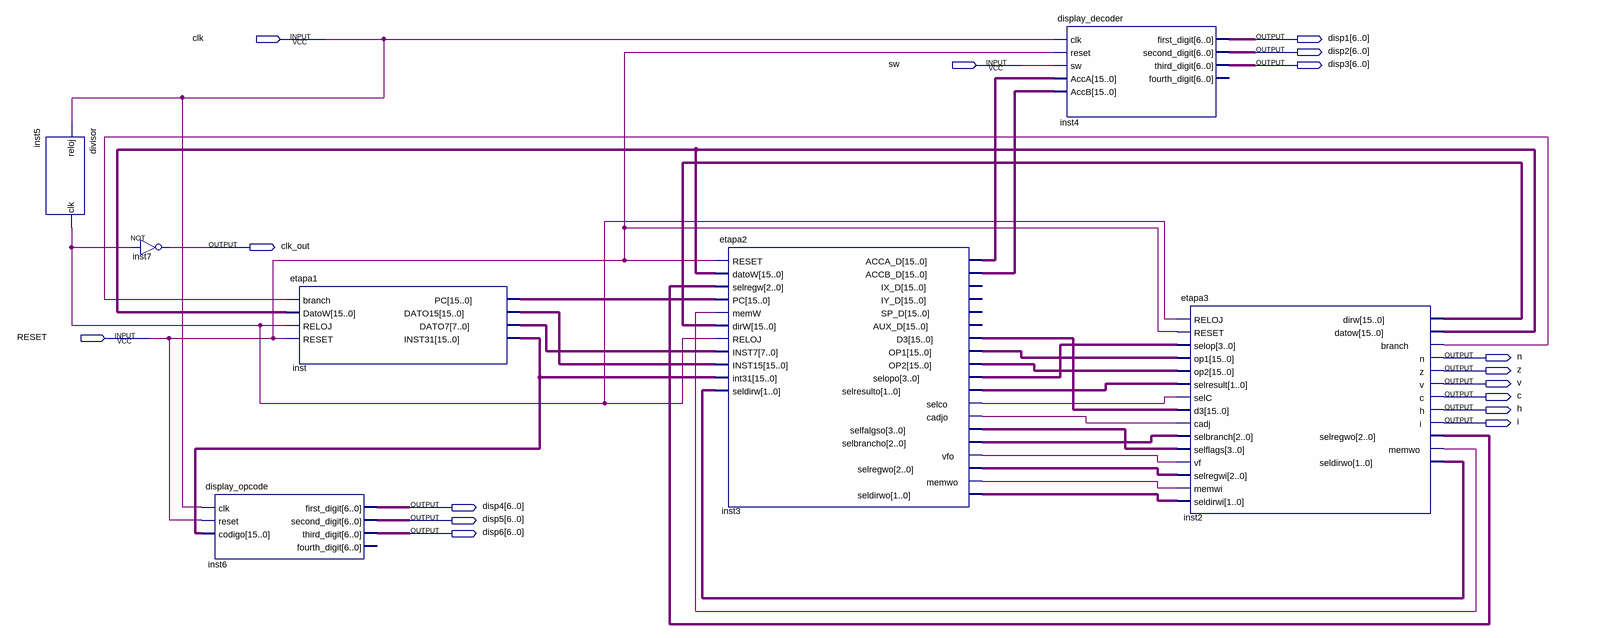
[diagram p0: schematic sheet]
// Quartus schematic pipeline.bdf as structural Verilog: 7 symbols, 16 pins
module pipeline (
  input  clk,
  input  sw,
  input  RESET,
  output [6:0] disp1,
  output [6:0] disp2,
  output [6:0] disp3,
  output clk_out,
  output n,
  output z,
  output v,
  output c,
  output h,
  output i,
  output [6:0] disp4,
  output [6:0] disp5,
  output [6:0] disp6
);

  wire inst2_branch, inst2_memwo, inst3_cadjo, inst3_memwo, inst3_selco, inst3_vfo, inst5_clk;
  wire [1:0] inst2_seldirwo, inst3_seldirwo, inst3_selresulto;
  wire [2:0] inst2_selregwo, inst3_selbrancho, inst3_selregwo;
  wire [3:0] inst3_selfalgso, inst3_selopo;
  wire [7:0] inst_dato7;
  wire [15:0] inst2_datow, inst2_dirw, inst3_acca_d, inst3_accb_d, inst3_d3, inst3_op1, inst3_op2,
       inst_dato15, inst_inst31, inst_pc;

  divisor inst5 (.reloj(clk), .clk(inst5_clk));
  not inst7 (clk_out, inst5_clk);
  display_opcode inst6 (
    .clk(clk), .reset(RESET), .codigo(inst_inst31), .first_digit(disp4), .second_digit(disp5),
    .third_digit(disp6));  // open: fourth_digit
  etapa1 inst (
    .branch(inst2_branch), .DatoW(inst2_datow), .RELOJ(inst5_clk), .RESET(RESET), .PC(inst_pc),
    .DATO15(inst_dato15), .DATO7(inst_dato7), .INST31(inst_inst31));
  etapa2 inst3 (
    .RESET(RESET), .datoW(inst2_datow), .selregw(inst2_selregwo), .PC(inst_pc), .memW(inst2_memwo),
    .dirW(inst2_dirw), .RELOJ(inst5_clk), .INST7(inst_dato7), .INST15(inst_dato15), .int31(inst_inst31),
    .seldirw(inst2_seldirwo), .ACCA_D(inst3_acca_d), .ACCB_D(inst3_accb_d), .D3(inst3_d3), .OP1(inst3_op1),
    .OP2(inst3_op2), .selopo(inst3_selopo), .selresulto(inst3_selresulto), .selco(inst3_selco),
    .cadjo(inst3_cadjo), .selfalgso(inst3_selfalgso), .selbrancho(inst3_selbrancho), .vfo(inst3_vfo),
    .selregwo(inst3_selregwo), .memwo(inst3_memwo), .seldirwo(inst3_seldirwo));  // open: IX_D, IY_D, SP_D, AUX_D
  display_decoder inst4 (
    .clk(clk), .reset(RESET), .sw(sw), .AccA(inst3_acca_d), .AccB(inst3_accb_d), .first_digit(disp1),
    .second_digit(disp2), .third_digit(disp3));  // open: fourth_digit
  etapa3 inst2 (
    .RELOJ(inst5_clk), .RESET(RESET), .selop(inst3_selopo), .op1(inst3_op1), .op2(inst3_op2),
    .selresult(inst3_selresulto), .selC(inst3_selco), .d3(inst3_d3), .cadj(inst3_cadjo),
    .selbranch(inst3_selbrancho), .selflags(inst3_selfalgso), .vf(inst3_vfo), .selregwi(inst3_selregwo),
    .memwi(inst3_memwo), .seldirwi(inst3_seldirwo), .dirw(inst2_dirw), .datow(inst2_datow),
    .branch(inst2_branch), .n(n), .z(z), .v(v), .c(c), .h(h), .i(i), .selregwo(inst2_selregwo),
    .memwo(inst2_memwo), .seldirwo(inst2_seldirwo));
endmodule
